# Altium schematic sheet [01]Main.SchDoc
size A4; SheetNumber: 1; SheetTotal: 5
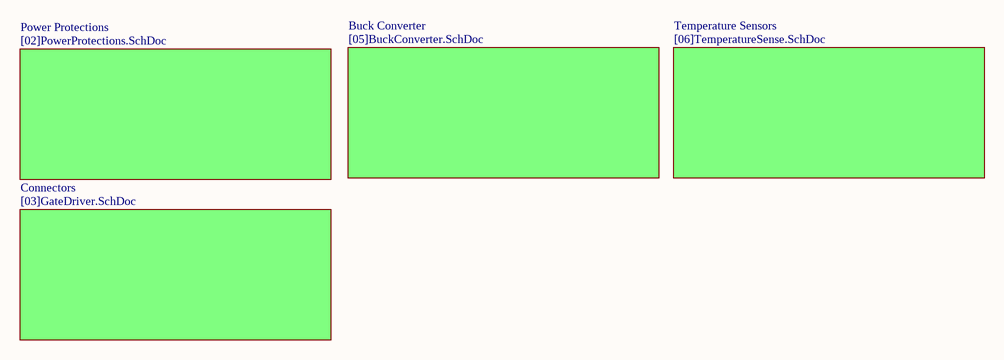
[diagram p0: [01]Main.SchDoc]

## Sub-sheets
Buck Converter = [05]BuckConverter.SchDoc: no entries
Connectors = [03]GateDriver.SchDoc: no entries
Power Protections = [02]PowerProtections.SchDoc: no entries
Temperature Sensors = [06]TemperatureSense.SchDoc: no entries

## Notes on the sheet
- Title:
- Size:
- Date:
- A4
- Number:
- Time:
- Revision:
- Sheet
- of
- Project
- Drawn By :